# Altium project MoonPilot.PrjPcb
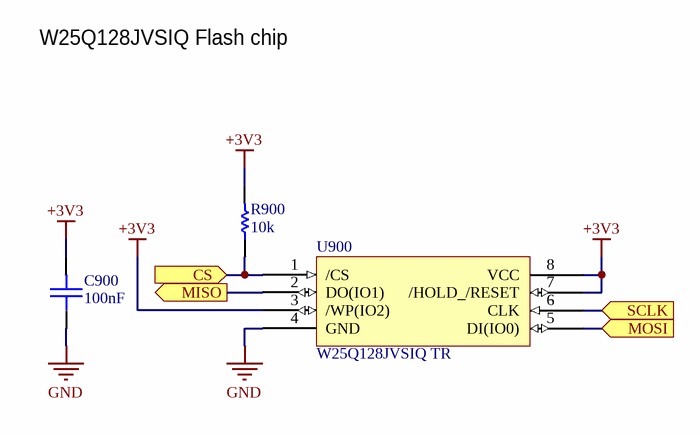
[diagram p0: Flash.SchDoc]
10 sheets, 117 parts. Net scope: hierarchical (ports join the sheet entries above them; power ports are global).
Board file: MoonPilot_Logic.PcbDoc
Sheets:
  Flash.SchDoc
  Main.SchDoc
    RP2040 = RP2040.SchDoc
    GNSS = GNSS.SchDoc
    IMU_MAG = IMU_MAG.SchDoc
    Power = Power.SchDoc
    Connectors = Connectors.SchDoc
    HI_CURR_1 = Hi_Current.SchDoc
    HI_CURR_2 = Hi_Current.SchDoc
    SD_Card = SD_Card.SchDoc
    LED & Buzzer = LED_Buzzer.SchDoc

## Sheet Flash.SchDoc: MoonPilot - Flash
size A3; DrawnBy: Máni Magnússon; Revision: A; SheetNumber: 9

### Parts
C900  100nF  [0603_CAP]
R900  10k  [0603_RES]
U900  W25Q128JVSIQ TR  [SOIC_208MIL_WIN]

### Ports
CS (in), MISO (out), MOSI (in), SCLK (in)

### Nets
+3V3: C900.1 R900.2 U900.3(/WP(IO2)) U900.7(/HOLD_/RESET) U900.8(VCC)
GND: C900.2 U900.4(GND)
NetR900_1: R900.1 U900.1(/CS) ; port CS
NetU900_2: U900.2(DO(IO1)) ; port MISO
NetU900_5: U900.5(DI(IO0)) ; port MOSI
NetU900_6: U900.6(CLK) ; port SCLK

### Notes on the sheet
- W25Q128JVSIQ Flash chip
- Sheet title:
- Revision:
- Drawn by:
- Date:
- File:

### Library data of the parts
C900 = Capacitor
R900 = Resistor
U900 = W25Q128JVSIQ TR: No Description Available; Vendor: Winbond; Built_By: EMA_Cory; SourceLibrary: Winbond_2020-02-06; Datasheet: https://www.winbond.com/resource-files/w25q128jv%20revf%2003272018%20plus.pdf; Manufacturer_Part_Number: W25Q128JVSIQ TR; Copyright: Copyright (C) 2018 Accelerated Designs. All rights reserved; RefDes: RefDes; Type: DEV

## Sheet Main.SchDoc: MoonPilot - Main
size A3; DrawnBy: Máni Magnússon; Revision: A; SheetNumber: 1
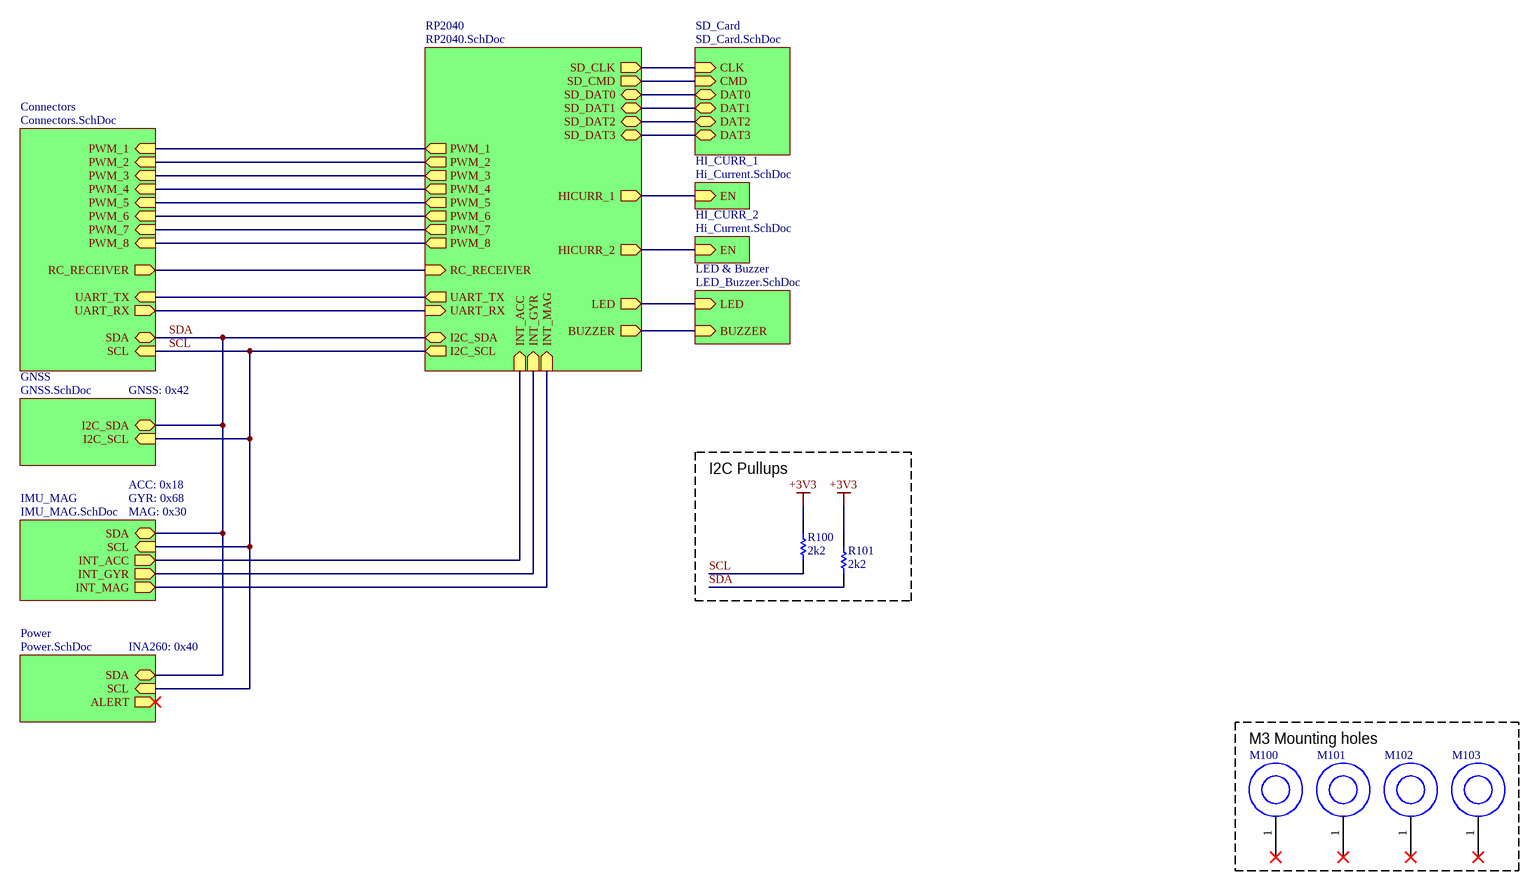
[diagram p1: Main.SchDoc]

### Parts
M100  Mounting Screw  [M3_SCREW]  (value not drawn)
M101  Mounting Screw  [M3_SCREW]  (value not drawn)
M102  Mounting Screw  [M3_SCREW]  (value not drawn)
M103  Mounting Screw  [M3_SCREW]  (value not drawn)
R100  2k2  [0603_RES]
R101  2k2  [0603_RES]

### Blocks framed on the sheet
I2C Pullups: R100 R101
M3 Mounting holes: M100-M103

### Sub-sheets
Connectors = Connectors.SchDoc: PWM_1 (in), PWM_2 (in), PWM_3 (in), PWM_4 (in), PWM_5 (in), PWM_6 (in), PWM_7 (in), PWM_8 (in), SDA (bidir), SCL (in), RC_RECEIVER (out), UART_TX (in), UART_RX (out)
GNSS = GNSS.SchDoc: I2C_SCL (in), I2C_SDA (bidir)
HI_CURR_1 = Hi_Current.SchDoc: EN (in)
HI_CURR_2 = Hi_Current.SchDoc: EN (in)
IMU_MAG = IMU_MAG.SchDoc: SDA (bidir), SCL (in), INT_ACC (out), INT_GYR (out), INT_MAG (out)
LED & Buzzer = LED_Buzzer.SchDoc: BUZZER (in), LED (in)
Power = Power.SchDoc: SCL (in), SDA (bidir), ALERT (out)
RP2040 = RP2040.SchDoc: PWM_1 (out), PWM_2 (out), PWM_3 (out), PWM_4 (out), PWM_5 (out), PWM_6 (out), PWM_7 (out), PWM_8 (out), HICURR_1 (out), HICURR_2 (out), UART_TX (out), UART_RX (in), I2C_SDA (bidir), I2C_SCL (out), SD_CLK (out), SD_CMD (out), SD_DAT0 (bidir), SD_DAT1 (bidir), SD_DAT2 (bidir), SD_DAT3 (bidir), RC_RECEIVER (in), LED (out), INT_MAG (in), INT_GYR (in), INT_ACC (in), BUZZER (out)
SD_Card = SD_Card.SchDoc: CLK (in), CMD (in), DAT0 (bidir), DAT1 (bidir), DAT2 (bidir), DAT3 (bidir)

### Nets
+3V3: R100.1 R101.1
SCL: R100.2 ; sheet RP2040/I2C_SCL, sheet GNSS/I2C_SCL, sheet IMU_MAG/SCL, sheet Power/SCL, sheet Connectors/SCL
SDA: R101.2 ; sheet RP2040/I2C_SDA, sheet GNSS/I2C_SDA, sheet IMU_MAG/SDA, sheet Power/SDA, sheet Connectors/SDA
NetJ600_1: sheet RP2040/PWM_1, sheet Connectors/PWM_1
NetJ601_1: sheet RP2040/PWM_2, sheet Connectors/PWM_2
NetJ602_1: sheet RP2040/PWM_3, sheet Connectors/PWM_3
NetJ603_1: sheet RP2040/PWM_4, sheet Connectors/PWM_4
NetJ604_1: sheet RP2040/PWM_5, sheet Connectors/PWM_5
NetJ605_2: sheet RP2040/RC_RECEIVER, sheet Connectors/RC_RECEIVER
NetJ606_1: sheet RP2040/PWM_6, sheet Connectors/PWM_6
NetJ607_1: sheet RP2040/PWM_7, sheet Connectors/PWM_7
NetJ608_1: sheet RP2040/PWM_8, sheet Connectors/PWM_8
NetJ609_2: sheet RP2040/UART_RX, sheet Connectors/UART_RX
NetJ609_3: sheet RP2040/UART_TX, sheet Connectors/UART_TX
NetJ800_P1: sheet RP2040/SD_DAT2, sheet SD_Card/DAT2
NetJ800_P2: sheet RP2040/SD_DAT3, sheet SD_Card/DAT3
NetJ800_P3: sheet RP2040/SD_CMD, sheet SD_Card/CMD
NetJ800_P5: sheet RP2040/SD_CLK, sheet SD_Card/CLK
NetJ800_P7: sheet RP2040/SD_DAT0, sheet SD_Card/DAT0
NetJ800_P8: sheet RP2040/SD_DAT1, sheet SD_Card/DAT1
NetQ1000_2: sheet RP2040/LED, sheet LED & Buzzer/LED
NetR700_HI_CURR_1_1: sheet RP2040/HICURR_1, sheet HI_CURR_1/EN
NetR700_HI_CURR_2_1: sheet RP2040/HICURR_2, sheet HI_CURR_2/EN
NetR1003_1: sheet RP2040/BUZZER, sheet LED & Buzzer/BUZZER
NetU201_11: sheet RP2040/INT_ACC, sheet IMU_MAG/INT_ACC
NetU201_12: sheet RP2040/INT_GYR, sheet IMU_MAG/INT_GYR
NetU201_13: sheet RP2040/INT_MAG, sheet IMU_MAG/INT_MAG

Not connected (* = marked no-connect by the designer): M100 1(19)*; M101 1(19)*; M102 1(19)*; M103 1(19)*

### Notes on the sheet
- GNSS: 0x42
- ACC: 0x18
- GYR: 0x68
- MAG: 0x30
- INA260: 0x40
- Sheet title:
- Revision:
- Drawn by:
- Date:
- File:

### Library data of the parts
M100-M103 = Mounting Screw: M4 and M3 scew holes, just pick the right footprint
R100 R101 = Resistor

## Sheet RP2040.SchDoc: MoonPilot - RP2040
size A3; DrawnBy: Máni Magnússon; Revision: A; SheetNumber: 2
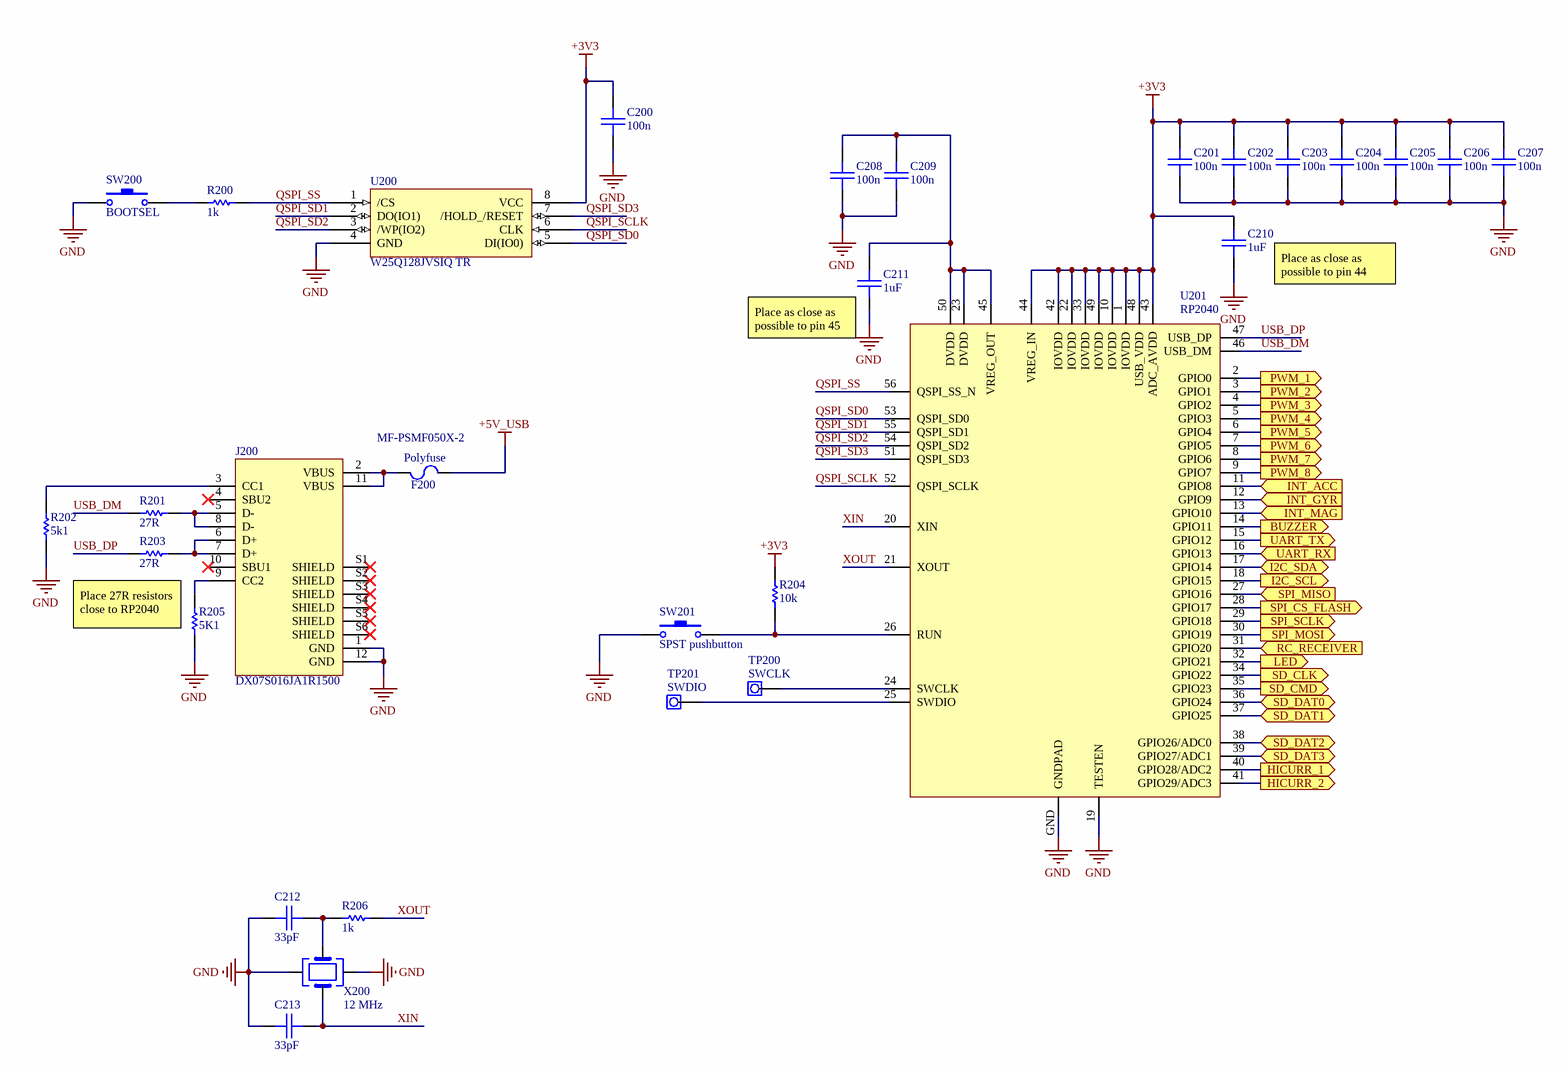
[diagram p2: RP2040.SchDoc]

### Parts
C200  100n  [0603_CAP]
C201  100n  [0603_CAP]
C202  100n  [0603_CAP]
C203  100n  [0603_CAP]
C204  100n  [0603_CAP]
C205  100n  [0603_CAP]
C206  100n  [0603_CAP]
C207  100n  [0603_CAP]
C208  100n  [0603_CAP]
C209  100n  [0603_CAP]
C210  1uF  [0603_CAP]
C211  1uF  [0603_CAP]
C212  33pF  [0603_CAP]
C213  33pF  [0603_CAP]
F200  Polyfuse  [0805]
J200  DX07S016JA1R1500  [JAE_DX07S016JA1R1500]
R200  1k  [0603_RES]
R201  27R  [0603_RES]
R202  5k1  [0603_RES]
R203  27R  [0603_RES]
R204  10k  [0805_RES]
R205  5K1  [0603_RES]
R206  1k  [0603_RES]
SW200  BOOTSEL  [TL1015]
SW201  SPST pushbutton  [TL1015]
TP200  SWCLK  [Testpoint]
TP201  SWDIO  [Testpoint]
U200  W25Q128JVSIQ TR  [SOIC_208MIL_WIN]
U201  RP2040  [RP2040]
X200  12 MHz  [XOSC_3.2mmx2.5mm]

### Ports
BUZZER (out), HICURR_1 (out), HICURR_2 (out), I2C_SCL (out), I2C_SDA (bidir), INT_ACC (in), INT_GYR (in), INT_MAG (in), LED (out), PWM_1 (out), PWM_2 (out), PWM_3 (out), PWM_4 (out), PWM_5 (out), PWM_6 (out), PWM_7 (out), PWM_8 (out), RC_RECEIVER (in), SD_CLK (out), SD_CMD (out), SD_DAT0 (bidir), SD_DAT1 (bidir), SD_DAT2 (bidir), SD_DAT3 (bidir), SPI_CS_FLASH (out), SPI_MISO (in), SPI_MOSI (out), SPI_SCLK (out), UART_RX (in), UART_TX (out)

### Nets
+3V3: C200.1 C201.1 C202.1 C203.1 C204.1 C205.1 C206.1 C207.1 C210.1 R204.1 U200.8(VCC) U201.1(IOVDD) U201.10(IOVDD) U201.22(IOVDD) U201.33(IOVDD) U201.42(IOVDD) U201.43(ADC_AVDD) U201.44(VREG_IN) U201.48(USB_VDD) U201.49(IOVDD)
+5V_USB: F200.2
GND: C200.2 C201.2 C202.2 C203.2 C204.2 C205.2 C206.2 C207.2 C208.2 C209.2 C210.2 C211.2 C212.2 C213.2 J200.1(GND) J200.12(GND) R202.2 R205.2 SW200.1 SW201.1 U200.4(GND) U201.19(TESTEN) U201.GND(GNDPAD) X200.2 X200.4
QSPI_SCLK: U200.6(CLK) U201.52(QSPI_SCLK)
QSPI_SD0: U200.5(DI(IO0)) U201.53(QSPI_SD0)
QSPI_SD1: U200.2(DO(IO1)) U201.55(QSPI_SD1)
QSPI_SD2: U200.3(/WP(IO2)) U201.54(QSPI_SD2)
QSPI_SD3: U200.7(/HOLD_/RESET) U201.51(QSPI_SD3)
QSPI_SS: R200.2 U200.1(/CS) U201.56(QSPI_SS_N)
SCL: U201.18(GPIO15) ; port I2C_SCL
SDA: U201.17(GPIO14) ; port I2C_SDA
USB_DM: R201.1 U201.46(USB_DM)
USB_DP: R203.1 U201.47(USB_DP)
XIN: C213.1 U201.20(XIN) X200.1
XOUT: R206.1 U201.21(XOUT)
NetC208_1: C208.1 C209.1 C211.1 U201.23(DVDD) U201.45(VREG_OUT) U201.50(DVDD)
NetC212_1: C212.1 R206.2 X200.3
NetF200_1: F200.1 J200.2(VBUS) J200.11(VBUS)
NetJ200_3: J200.3(CC1) R202.1
NetJ200_5: J200.5(D-) J200.8(D-) R201.2
NetJ200_6: J200.6(D+) J200.7(D+) R203.2
NetJ200_9: J200.9(CC2) R205.1
NetJ600_1: U201.2(GPIO0) ; port PWM_1
NetJ601_1: U201.3(GPIO1) ; port PWM_2
NetJ602_1: U201.4(GPIO2) ; port PWM_3
NetJ603_1: U201.5(GPIO3) ; port PWM_4
NetJ604_1: U201.6(GPIO4) ; port PWM_5
NetJ605_2: U201.31(GPIO20) ; port RC_RECEIVER
NetJ606_1: U201.7(GPIO5) ; port PWM_6
NetJ607_1: U201.8(GPIO6) ; port PWM_7
NetJ608_1: U201.9(GPIO7) ; port PWM_8
NetJ609_2: U201.16(GPIO13) ; port UART_RX
NetJ609_3: U201.15(GPIO12) ; port UART_TX
NetJ800_P1: U201.38(GPIO26/ADC0) ; port SD_DAT2
NetJ800_P2: U201.39(GPIO27/ADC1) ; port SD_DAT3
NetJ800_P3: U201.35(GPIO23) ; port SD_CMD
NetJ800_P5: U201.34(GPIO22) ; port SD_CLK
NetJ800_P7: U201.36(GPIO24) ; port SD_DAT0
NetJ800_P8: U201.37(GPIO25) ; port SD_DAT1
NetQ1000_2: U201.32(GPIO21) ; port LED
NetR200_1: R200.1 SW200.2
NetR204_2: R204.2 SW201.2 U201.26(RUN)
NetR700_HI_CURR_1_1: U201.40(GPIO28/ADC2) ; port HICURR_1
NetR700_HI_CURR_2_1: U201.41(GPIO29/ADC3) ; port HICURR_2
NetR1003_1: U201.14(GPIO11) ; port BUZZER
NetTP200_1: TP200.1 U201.24(SWCLK)
NetTP201_1: TP201.1 U201.25(SWDIO)
NetU201_11: U201.11(GPIO8) ; port INT_ACC
NetU201_12: U201.12(GPIO9) ; port INT_GYR
NetU201_13: U201.13(GPIO10) ; port INT_MAG
NetU201_27: U201.27(GPIO16) ; port SPI_MISO
NetU201_28: U201.28(GPIO17) ; port SPI_CS_FLASH
NetU201_29: U201.29(GPIO18) ; port SPI_SCLK
NetU201_30: U201.30(GPIO19) ; port SPI_MOSI

Not connected (* = marked no-connect by the designer): J200 4(SBU2)* 10(SBU1)* S1(SHIELD)* S2(SHIELD)* S3(SHIELD)* S4(SHIELD)* S5(SHIELD)* S6(SHIELD)*

### Notes on the sheet
- (near C210) Place as close as possible to pin 44
- (near C211) Place as close as possible to pin 45
- MF-PSMF050X-2
- (near R205) Place 27R resistors close to RP2040
- Sheet title:
- Revision:
- Drawn by:
- Date:
- File:

### Library data of the parts
C200-C213 = Capacitor
F200 = Fuse
J200 = DX07S016JA1R1500: USB 2.0 Type C Receptacle Dip Type, PCB Top Mount (Digikey part no. 670-DX07S016JA1R1500CT-ND); MF: JAE Electronics; Value: *; Price: None; Package: None; Availability: Unavailable; MP: DX07S016JA1R1500; DigiKey-Purchase-URL: https://snapeda.com/shop?store=DigiKey&id=4551013; SnapEDA_Link: https://www.snapeda.com/parts/DX07S016JA1R1500/JAE%20Electronics/view-part/4551013/?ref=snap
R200-R206 = Resistor
SW200 SW201 = PushButton: DigiKey part no. EG4344CT-ND
TP200 TP201 = Testpoint
U200 = W25Q128JVSIQ TR: as U900 on sheet Flash; Datasheet: https://www.winbond.com/resource-files/w25q128jv%20revf%2003272018%20plus.pdf; Manufacturer_Part_Number: W25Q128JVSIQ TR; Copyright: Copyright (C) 2018 Accelerated Designs. All rights reserved; RefDes: RefDes; Type: DEV
X200 = XTAL_12 MHz: 12 MHz crystal oscillator / ECS-120-20-33-CKM-TR / DigiKey part no. XC1810CT-ND; ComponentLink1Description: DigiKey; ComponentLink1URL: https://www.digikey.com/en/products/detail/ecs-inc/ECS-120-20-33-CKM-TR/2781815; DigiKey: XC1810CT-ND

## Sheet GNSS.SchDoc: MoonPilot - GNSS
size A3; DrawnBy: Máni Magnússon; Revision: A; SheetNumber: 3
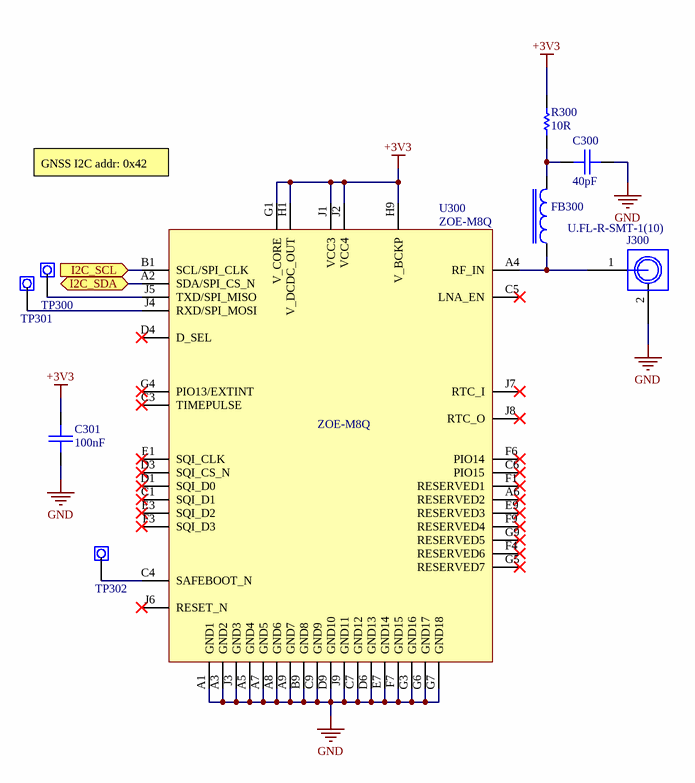
[diagram p3: GNSS.SchDoc]

### Parts
C300  40pF  [0603_CAP]
C301  100nF  [0603_CAP]
FB300  FBTH1608HL221-T  [0603_FERRITE]  (value not drawn)
J300  U.FL-R-SMT-1(10)  [U.FL-R-SMT-1(10)]
R300  10R  [0603_RES]
TP300  GPS_TX  [Testpoint]  (value not drawn)
TP301  GPS_RX  [Testpoint]  (value not drawn)
TP302  GPS_SAFEBOOT  [Testpoint2]  (value not drawn)
U300  ZOE-M8Q  [ZOE-M8Q]

### Ports
I2C_SCL (in), I2C_SDA (bidir)

### Nets
+3V3: C301.1 R300.1 U300.G1(V_CORE) U300.H1(V_DCDC_OUT) U300.H9(V_BCKP) U300.J1(VCC3) U300.J2(VCC4)
GND: C300.2 C301.2 J300.2(GND) U300.A1(GND1) U300.A3(GND2) U300.A5(GND4) U300.A7(GND5) U300.A8(GND6) U300.A9(GND7) U300.B9(GND8) U300.C7(GND12) U300.C9(GND9) U300.D6(GND13) U300.D9(GND10) U300.E7(GND14) U300.F7(GND15) U300.G3(GND16) U300.G6(GND17) U300.G7(GND18) U300.J3(GND3) U300.J9(GND11)
SCL: U300.B1(SCL/SPI_CLK) ; port I2C_SCL
SDA: U300.A2(SDA/SPI_CS_N) ; port I2C_SDA
NetC300_1: C300.1 FB300.2 R300.2
NetFB300_1: FB300.1 J300.1(SIG) U300.A4(RF_IN)
NetTP300_1: TP300.1 U300.J5(TXD/SPI_MISO)
NetTP301_1: TP301.1 U300.J4(RXD/SPI_MOSI)
NetTP302_1: TP302.1 U300.C4(SAFEBOOT_N)

Not connected (* = marked no-connect by the designer): U300 A6(RESERVED2)* C1(SQI_D1)* C3(TIMEPULSE)* C5(LNA_EN)* C6(PIO15)* D1(SQI_D0)* D3(SQI_CS_N)* D4(D_SEL)* E1(SQI_CLK)* E3(SQI_D2)* E9(RESERVED3)* F1(RESERVED1)* F3(SQI_D3)* F4(RESERVED6)* F6(PIO14)* F9(RESERVED4)* G4(PIO13/EXTINT)* G5(RESERVED7)* G9(RESERVED5)* J6(RESET_N)* J7(RTC_I)* J8(RTC_O)*

### Notes on the sheet
- GNSS I2C addr: 0x42
- Sheet title:
- Revision:
- Drawn by:
- Date:
- File:

### Library data of the parts
C300 C301 = Capacitor
FB300 = Ferrite Bead: Digikey part no. / 587-FBTH1608HL221-TCT-ND
J300 = U.FL SMD: Digikey part no. H11891CT-ND
R300 = Resistor
TP300-TP302 = Testpoint
U300 = ZOE-M8Q: u-blox ZOE GNSS module; Part Description: u-blox ZOE-M8Q GNSS module; Manufacturer: u-blox; Value: ZOE-M8Q

## Sheet IMU_MAG.SchDoc: MoonPilot - IMU & MAG
size A3; DrawnBy: Máni Magnússon; Revision: A; SheetNumber: 4
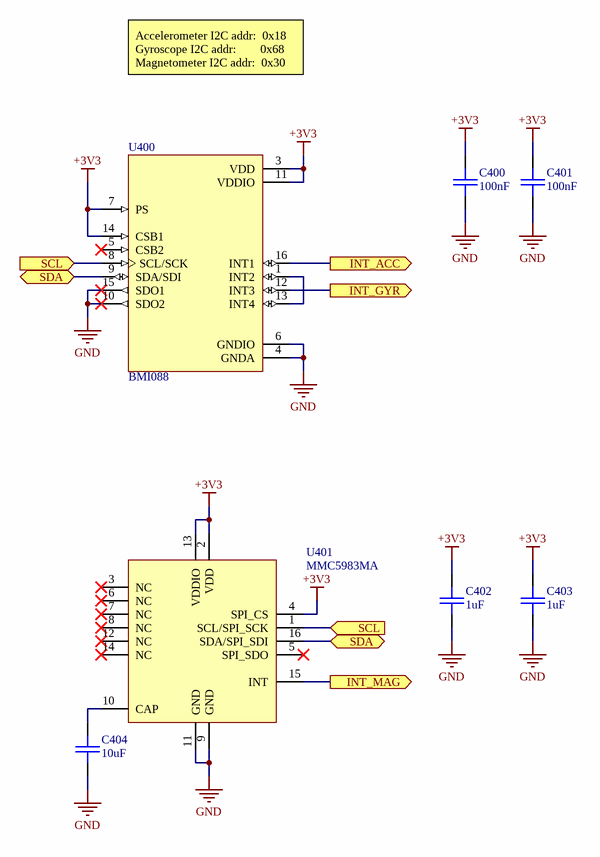
[diagram p4: IMU_MAG.SchDoc]

### Parts
C400  100nF  [0603_CAP]
C401  100nF  [0603_CAP]
C402  1uF  [0603_CAP]
C403  1uF  [0603_CAP]
C404  10uF  [0603_CAP]
U400  BMI088  [BMI088]
U401  MMC5983MA  [MMC5983MA]

### Ports
INT_ACC (out), INT_GYR (out), INT_MAG (out), SCL (in), SDA (bidir)

### Nets
+3V3: C400.1 C401.1 C402.1 C403.1 U400.3(VDD) U400.7(PS) U400.11(VDDIO) U400.14(CSB1) U401.2(VDD) U401.4(SPI_CS) U401.13(VDDIO)
GND: C400.2 C401.2 C402.2 C403.2 C404.2 U400.4(GNDA) U400.6(GNDIO) U400.10(SDO2) U400.15(SDO1) U401.9(GND) U401.11(GND)
SCL: U400.8(SCL/SCK) U401.1(SCL/SPI_SCK) ; port SCL
SDA: U400.9(SDA/SDI) U401.16(SDA/SPI_SDI) ; port SDA
NetC404_1: C404.1 U401.10(CAP)
NetU201_11: U400.16(INT1) ; port INT_ACC
NetU201_12: U400.12(INT3) ; port INT_GYR
NetU201_13: U401.15(INT) ; port INT_MAG
NetU400_1: U400.1(INT2) U400.13(INT4)

Not connected (* = marked no-connect by the designer): U400 5(CSB2)*; U401 3(NC)* 5(SPI_SDO)* 6(NC)* 7(NC)* 8(NC)* 12(NC)* 14(NC)*

### Notes on the sheet
- Accelerometer I2C addr:  0x18
  Gyroscope I2C addr:        0x68
  Magnetometer I2C addr:  0x30
- Sheet title:
- Revision:
- Drawn by:
- Date:
- File:

### Library data of the parts
C400-C404 = Capacitor
U400 = BMI088: Digikey part no. 828-1082-1-ND; MF: Bosch Sensortec; Availability: Unavailable; MP: BMI088; Price: None; Value: *; SnapEDA_Link: https://www.snapeda.com/parts/BMI088/Bosch%20Sensortec/view-part/2774026/?ref=snap; Package: VFLGA-16 Bosch Sensortec
U401 = MMC5983MA: 3 axis magnetometer; Supplier 1: Digi-Key; Supplier Part Number 1: 1267-MMC5983MACT-ND

## Sheet Power.SchDoc: MoonPilot -  Power
size A3; DrawnBy: Máni Magnússon; Revision: A; SheetNumber: 5
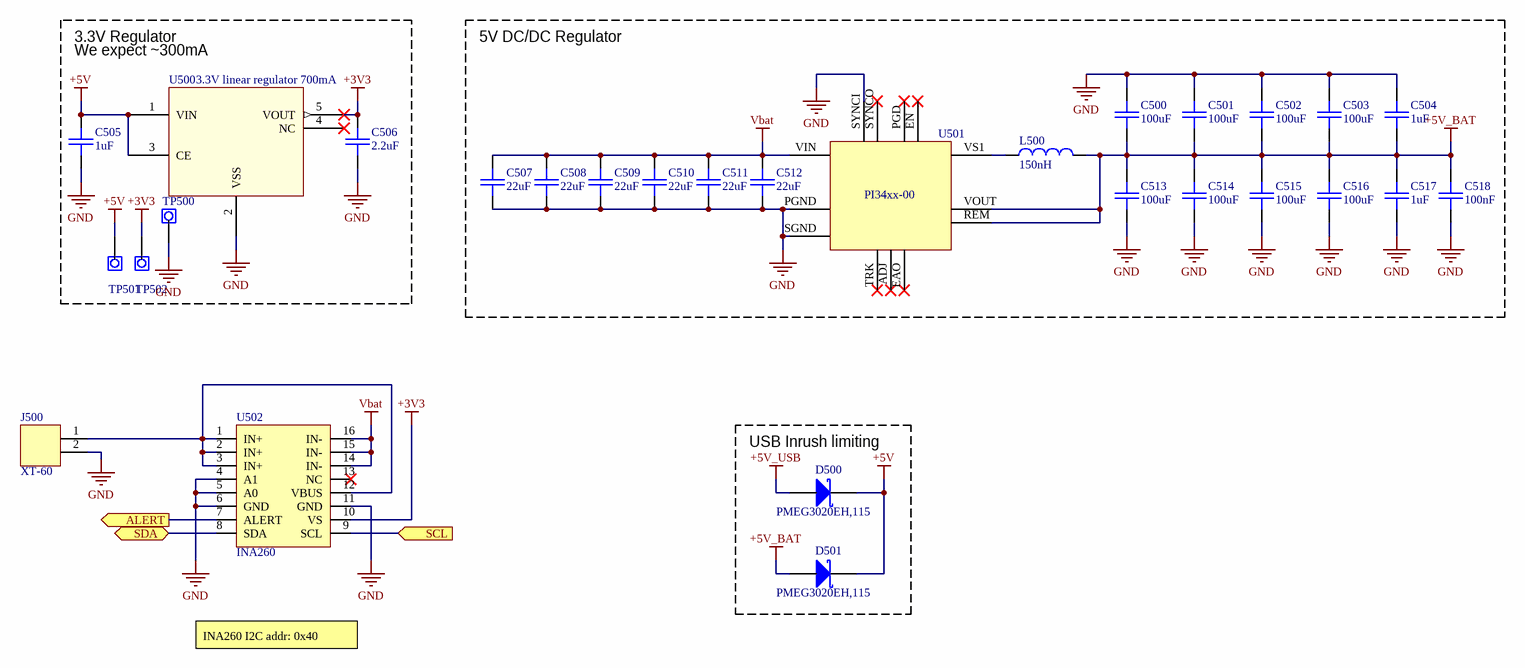
[diagram p5: Power.SchDoc]

### Parts
C500  100uF  [1206_CAP]
C501  100uF  [1206_CAP]
C502  100uF  [1206_CAP]
C503  100uF  [1206_CAP]
C504  1uF  [0805_cap]
C505  1uF  [0603_CAP]
C506  2.2uF  [0603_CAP]
C507  22uF  [1206_CAP]
C508  22uF  [1206_CAP]
C509  22uF  [1206_CAP]
C510  22uF  [1206_CAP]
C511  22uF  [1206_CAP]
C512  22uF  [1206_CAP]
C513  100uF  [1206_CAP]
C514  100uF  [1206_CAP]
C515  100uF  [1206_CAP]
C516  100uF  [1206_CAP]
C517  1uF  [0805_cap]
C518  100nF  [1206_CAP]
D500  PMEG3020EH,115  [SOD-123]
D501  PMEG3020EH,115  [SOD-123]
J500  XT-60  [XT-60]
L500  150nH  [FPV1006-150-R]
TP500  GND  [Testpoint2]  (value not drawn)
TP501  5V  [Testpoint2]  (value not drawn)
TP502  3.3V  [Testpoint2]  (value not drawn)
U500  3.3V linear regulator 700mA  [SOT-25_TOR]
U501  PI34xx-00  [PI34xx-00]
U502  INA260  [TSSOP-16]

### Blocks framed on the sheet
5V DC/DC Regulator: C500-C504 C507-C518 L500 U501
USB Inrush limiting: D500 D501

### Ports
ALERT (out), SCL (in), SDA (bidir)

### Nets
+3V3: C506.1 TP502.1 U500.5(VOUT) U502.10(VS)
+5V: C505.1 D500.2(K) D501.2(K) TP501.1 U500.1(VIN) U500.3(CE)
+5V_BAT: C500.2 C501.2 C502.2 C503.2 C504.2 C513.1 C514.1 C515.1 C516.1 C517.1 C518.1 D501.1(A) L500.2 U501.REM U501.VOUT
+5V_USB: D500.1(A)
GND: C500.1 C501.1 C502.1 C503.1 C504.1 C505.2 C506.2 C507.2 C508.2 C509.2 C510.2 C511.2 C512.2 C513.2 C514.2 C515.2 C516.2 C517.2 C518.2 J500.2 TP500.1 U500.2(VSS) U501.PGND U501.SGND U501.SYNCI U502.4(A1) U502.5(A0) U502.6(GND) U502.11(GND)
Vbat: C507.1 C508.1 C509.1 C510.1 C511.1 C512.1 U501.VIN U502.14(IN-) U502.15(IN-) U502.16(IN-)
SCL: U502.9(SCL) ; port SCL
SDA: U502.8(SDA) ; port SDA
NetJ500_1: J500.1 U502.1(IN+) U502.2(IN+) U502.3(IN+) U502.12(VBUS)
NetL500_1: L500.1 U501.VS1
NetU502_7: U502.7(ALERT) ; port ALERT

Not connected (* = marked no-connect by the designer): U500 4(NC)*; U501 ADJ* EAO* EN* PGD* SYNCO* TRK*; U502 13(NC)*

### Notes on the sheet
- 3.3V Regulator
- We expect ~300mA
- INA260 I2C addr: 0x40
- Sheet title:
- Revision:
- Drawn by:
- Date:
- File:

### Library data of the parts
C500-C518 = Capacitor
D500 D501 = Schottky diode
J500 = XT-60: Digikey part no. 1568-1816-ND
L500 = Inductor
TP500-TP502 = Testpoint
U500 = XC6222B331MR-G: Digikey part no. 893-1143-1-ND; Vendor: Torex Semiconductor; Built_By: EMA_UL_Team; SourceLibrary: Torex_2016-07-11_1; Manufacturer_Part_Number: XC6222B331MR-G; Copyright: Copyright (C) 2018 Accelerated Designs. All rights reserved; RefDes: RefDes; Type: DEV
U501 = PI34xx-00: Digikey part no. 1102-1641-ND
U502 = INA260: ComponentLink1Description: Datasheet; ComponentLink1URL: https://www.ti.com/lit/ds/symlink/ina260.pdf?ts=1625223015380&ref_url=https%253A%252F%252Fwww.google.com%252F

## Sheet Connectors.SchDoc: MoonPilot - Connectors
size A3; DrawnBy: Máni Magnússon; Revision: A; SheetNumber: 6
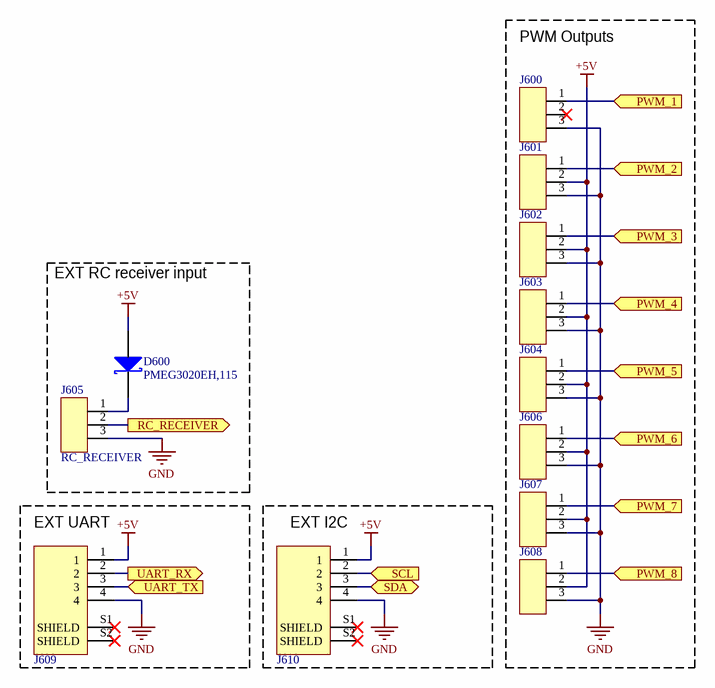
[diagram p6: Connectors.SchDoc]

### Parts
D600  PMEG3020EH,115  [SOD-123]
J600  Generic 3 pin 100 mil header  [HEADER-3-POS_100_mil]  (value not drawn)
J601  Generic 3 pin 100 mil header  [HEADER-3-POS_100_mil]  (value not drawn)
J602  Generic 3 pin 100 mil header  [HEADER-3-POS_100_mil]  (value not drawn)
J603  Generic 3 pin 100 mil header  [HEADER-3-POS_100_mil]  (value not drawn)
J604  Generic 3 pin 100 mil header  [HEADER-3-POS_100_mil]  (value not drawn)
J605  RC_RECEIVER  [HEADER-3-POS_100_mil]
J606  Generic 3 pin 100 mil header  [HEADER-3-POS_100_mil]  (value not drawn)
J607  Generic 3 pin 100 mil header  [HEADER-3-POS_100_mil]  (value not drawn)
J608  Generic 3 pin 100 mil header  [HEADER-3-POS_100_mil]  (value not drawn)
J609  4 pin vertical JST GH  [JST_BM04B-GHS-TBT(LF)(SN)(N)]  (value not drawn)
J610  4 pin vertical JST GH  [JST_BM04B-GHS-TBT(LF)(SN)(N)]  (value not drawn)

### Blocks framed on the sheet
PWM Outputs: J600-J604 J606-J608
EXT RC receiver input: D600 J605
EXT UART: J609
EXT I2C: J610

### Ports
PWM_1 (in), PWM_2 (in), PWM_3 (in), PWM_4 (in), PWM_5 (in), PWM_6 (in), PWM_7 (in), PWM_8 (in), RC_RECEIVER (out), SCL (in), SDA (bidir), UART_RX (out), UART_TX (in)

### Nets
+5V: D600.1(A) J601.2 J602.2 J603.2 J604.2 J606.2 J607.2 J608.2 J609.1 J610.1
GND: J600.3 J601.3 J602.3 J603.3 J604.3 J605.3 J606.3 J607.3 J608.3 J609.4 J610.4
SCL: J610.2 ; port SCL
SDA: J610.3 ; port SDA
NetD600_2: D600.2(K) J605.1
NetJ600_1: J600.1 ; port PWM_1
NetJ601_1: J601.1 ; port PWM_2
NetJ602_1: J602.1 ; port PWM_3
NetJ603_1: J603.1 ; port PWM_4
NetJ604_1: J604.1 ; port PWM_5
NetJ605_2: J605.2 ; port RC_RECEIVER
NetJ606_1: J606.1 ; port PWM_6
NetJ607_1: J607.1 ; port PWM_7
NetJ608_1: J608.1 ; port PWM_8
NetJ609_2: J609.2 ; port UART_RX
NetJ609_3: J609.3 ; port UART_TX

Not connected (* = marked no-connect by the designer): J600 2(*)*; J609 S1(SHIELD)* S2(SHIELD)*; J610 S1(SHIELD)* S2(SHIELD)*

### Notes on the sheet
- Sheet title:
- Revision:
- Drawn by:
- Date:
- File:

### Library data of the parts
D600 = Schottky diode: Digikey part no. 1727-3873-1-ND
J600-J608 = 3 pin 100 mil header
J609 J610 = BM04B-GHS-TBT(LF)(SN)(N): JST GH vertical 4 pin / DigiKey part no. 455-1580-1-ND; MF: JST Sales; MP: BM04B-GHS-TBT_LF__SN__N_; SnapEDA_Link: https://www.snapeda.com/parts/BM04B-GHS-TBT%28LF%29%28SN%29%28N%29/JST%20Sales%20America%20Inc./view-part/841999/?ref=snap; Digi-Key_Part_Number: 455-1580-1-ND; Digi-Key_Purchase_URL: https://www.digikey.com/product-detail/en/jst-sales-america-inc/BM04B-GHS-TBT_LF__SN__N_/455-1580-1-ND/807848?utm_source=snapeda&utm_medium=aggregator&utm_campaign=symbol; Value: *; Package: None

## Sheet Hi_Current.SchDoc: MoonPilot - Hi Current Out
size A3; DrawnBy: Máni Magnússon; Revision: A; SheetNumber: 7
Used 2 times, as channels HI_CURR_1, HI_CURR_2. Parts and nets are listed once, with the designators drawn on the sheet.
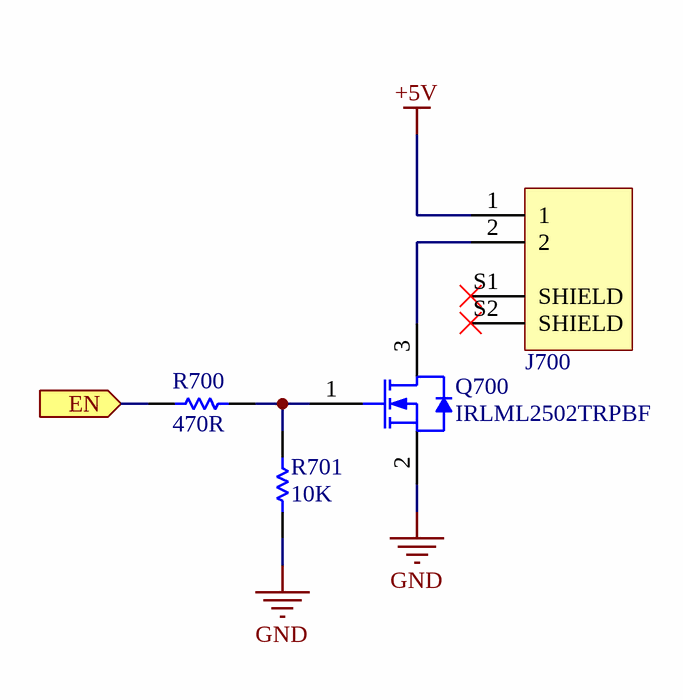
[diagram p7: Hi_Current.SchDoc]

### Parts
J700  2 pin vertical JST GH  [JST_BM02B-GHS-TBT(LF)(SN)(N)]  (value not drawn)
Q700  IRLML2502TRPBF  [INTR-SOT-23-3_V]
R700  470R  [0603_RES]
R701  10K  [0603_RES]

### Ports
EN (in)

### Nets
+5V: J700.1
GND: Q700.2(S) R701.2
EN: R700.1 ; port EN
NetJ700_2: J700.2 Q700.3(D)
NetQ700_1: Q700.1(G) R700.2 R701.1

Not connected (* = marked no-connect by the designer): J700 S1(SHIELD)* S2(SHIELD)*

### Channels
HI_CURR_1: designators end in _HI_CURR_1; ports EN=NetR700_HI_CURR_1_1
HI_CURR_2: designators end in _HI_CURR_2; ports EN=NetR700_HI_CURR_2_1

### Notes on the sheet
- Sheet title:
- Revision:
- Drawn by:
- Date:
- File:

### Library data of the parts
J700 = BM02B-GHS-TBT(LF)(SN)(N): JST GH vertical 2 pin / DigiKey part no. 455-1578-1-ND; MF: JST Sales; MP: BM04B-GHS-TBT_LF__SN__N_; SnapEDA_Link: https://www.snapeda.com/parts/BM04B-GHS-TBT%28LF%29%28SN%29%28N%29/JST%20Sales%20America%20Inc./view-part/841999/?ref=snap; Digi-Key_Part_Number: 455-1580-1-ND; Digi-Key_Purchase_URL: https://www.digikey.com/product-detail/en/jst-sales-america-inc/BM04B-GHS-TBT_LF__SN__N_/455-1580-1-ND/807848?utm_source=snapeda&utm_medium=aggregator&utm_campaign=symbol; Value: *; Package: None
Q700 = IRLML2502TRPBF: N-Channel HEXFET(R) Power MOSFET, 20 V VDS, +/- 12 V VGS, 4.2 A, 3-Pin SOT23, RoHS, Tape and Reel; Manufacturer: International Rectifier; Drain-to-Source Voltage [Vdss]: 20V; Drain-Source On Resistance-Max: 0.045O; Qg Gate Charge: 8nC; Rated Power Dissipation: 1.25W; Package Reference: SOT-23-3; Manufacturer URL: http://internationalrectifier.com/; Package Description: 3-Pin Small Outline Transistor, Body 2.92 x 1.3 mm, Pitch 0.95 mm; Datasheet Version: Apr-14; Channel Type: N-Channel; Datasheet URL: https://datasheet.ciiva.com/6383/irlml2502pbf-6383216.pdf
R700 R701 = Resistor

## Sheet SD_Card.SchDoc: MoonPilot - SD Card
size A3; DrawnBy: Máni Magnússon; Revision: A; SheetNumber: 8
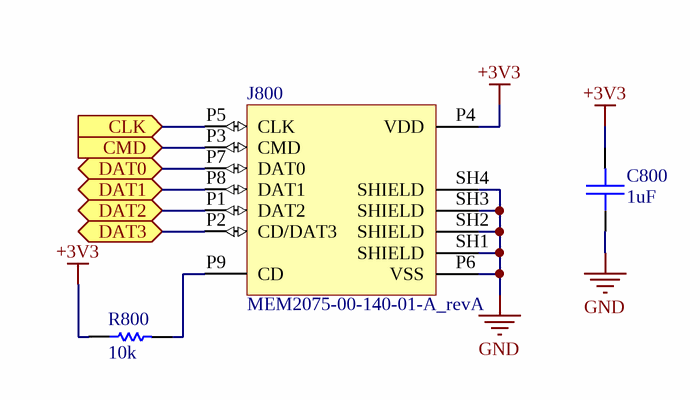
[diagram p8: SD_Card.SchDoc]

### Parts
C800  1uF  [0603_CAP]
J800  MEM2075-00-140-01-A_revA  [MEM2075-00-140-01-A_revA]
R800  10k  [0603_RES]

### Ports
CLK (in), CMD (in), DAT0 (bidir), DAT1 (bidir), DAT2 (bidir), DAT3 (bidir)

### Nets
+3V3: C800.1 J800.P4(VDD) R800.1
GND: C800.2 J800.P6(VSS) J800.SH1(SHIELD) J800.SH2(SHIELD) J800.SH3(SHIELD) J800.SH4(SHIELD)
NetJ800_P1: J800.P1(DAT2) ; port DAT2
NetJ800_P2: J800.P2(CD/DAT3) ; port DAT3
NetJ800_P3: J800.P3(CMD) ; port CMD
NetJ800_P5: J800.P5(CLK) ; port CLK
NetJ800_P7: J800.P7(DAT0) ; port DAT0
NetJ800_P8: J800.P8(DAT1) ; port DAT1
NetJ800_P9: J800.P9(CD) R800.2

### Notes on the sheet
- Sheet title:
- Revision:
- Drawn by:
- Date:
- File:

### Library data of the parts
C800 = Capacitor
J800 = MicroSD Card holder: Push-Push style MicroSD Card holder / Digikey part no. 2073-MEM2075-00-140-01-ACT-ND; Manufacturer: GCT; PartRev: A; STANDARD: Manufacturer Recommendations; Package: GCT_MEM2075-00-140-01-A_revA
R800 = Resistor

## Sheet LED_Buzzer.SchDoc: MoonPilot - LED & Buzzer
size A3; DrawnBy: Máni Magnússon; Revision: A; SheetNumber: 10
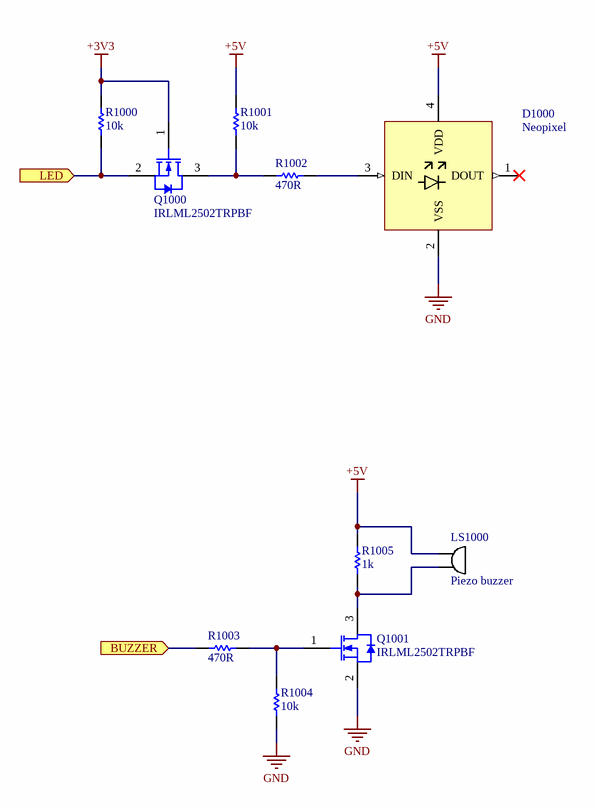
[diagram p9: LED_Buzzer.SchDoc]

### Parts
D1000  Neopixel  [2659]
LS1000  Piezo buzzer  [CPT-9019S-SMT-TR]
Q1000  IRLML2502TRPBF  [INTR-SOT-23-3_V]
Q1001  IRLML2502TRPBF  [INTR-SOT-23-3_V]
R1000  10k  [0603_RES]
R1001  10k  [0603_RES]
R1002  470R  [0603_RES]
R1003  470R  [0603_RES]
R1004  10k  [0603_RES]
R1005  1k  [0603_RES]

### Ports
BUZZER (in), LED (in)

### Nets
+3V3: Q1000.1(G) R1000.2
+5V: D1000.4(VDD) LS1000.1 R1001.1 R1005.1
GND: D1000.2(VSS) Q1001.2(S) R1004.1
NetD1000_3: D1000.3(DIN) R1002.2
NetLS1000_2: LS1000.2 Q1001.3(D) R1005.2
NetQ1000_2: Q1000.2(S) R1000.1 ; port LED
NetQ1000_3: Q1000.3(D) R1001.2 R1002.1
NetQ1001_1: Q1001.1(G) R1003.2 R1004.2
NetR1003_1: R1003.1 ; port BUZZER

Not connected (* = marked no-connect by the designer): D1000 1(DOUT)*

### Notes on the sheet
- Sheet title:
- Revision:
- Drawn by:
- Date:
- File:

### Library data of the parts
D1000 = Neopixel: Adafruit Neopixel SMD 3535 / Adafruit part no. 2659 / Digikey part no. 1528-1542-ND; MF: Adafruit Industries; MP: 2659; SnapEDA_Link: https://www.snapeda.com/parts/2659/Adafruit%20Industries%20LLC/view-part/548522/?ref=snap; Package: TQFP-32 Adafruit Industries; Digi-Key_Purchase_URL: https://www.digikey.com/product-detail/en/pololu-corporation/2659/2183-2659-ND/10451102?utm_source=snapeda&utm_medium=aggregator&utm_campaign=symbol; Digi-Key_Part_Number: 2183-2659-ND; Value: *
LS1000 = Buzzer: 4kHz 65 dB @ 3V passive piezoelectric buzzer; Supplier 1: Digi-Key; Supplier Part Number 1: 102-3761-1-ND
Q1000 Q1001 = IRLML2502TRPBF: as Q700 on sheet Hi_Current; Package Reference: SOT-23-3; Manufacturer URL: http://internationalrectifier.com/; Package Description: 3-Pin Small Outline Transistor, Body 2.92 x 1.3 mm, Pitch 0.95 mm; Datasheet Version: Apr-14; Channel Type: N-Channel; Datasheet URL: https://datasheet.ciiva.com/6383/irlml2502pbf-6383216.pdf
R1000-R1005 = Resistor

## Nets that join several sheets
+3V3: Flash (5 pins), Main (R100.1 R101.1), RP2040 (20 pins), GNSS (7 pins), IMU_MAG (11 pins), Power (C506.1 TP502.1 U500.5 U502.10), SD_Card (C800.1 J800.P4 R800.1), LED_Buzzer (Q1000.1 R1000.2)
+5V: Power (6 pins), Connectors (10 pins), HI_CURR_1 (J700_HI_CURR_1.1), HI_CURR_2 (J700_HI_CURR_2.1), LED_Buzzer (D1000.4 LS1000.1 R1001.1 R1005.1)
+5V_USB: RP2040 (F200.2), Power (D500.1)
GND: Flash (C900.2 U900.4), RP2040 (25 pins), GNSS (21 pins), IMU_MAG (11 pins), Power (29 pins), Connectors (11 pins), HI_CURR_1 (Q700_HI_CURR_1.2 R701_HI_CURR_1.2), HI_CURR_2 (Q700_HI_CURR_2.2 R701_HI_CURR_2.2), SD_Card (6 pins), LED_Buzzer (D1000.2 Q1001.2 R1004.1)
NetJ600_1: RP2040 (U201.2), Connectors (J600.1)
NetJ601_1: RP2040 (U201.3), Connectors (J601.1)
NetJ602_1: RP2040 (U201.4), Connectors (J602.1)
NetJ603_1: RP2040 (U201.5), Connectors (J603.1)
NetJ604_1: RP2040 (U201.6), Connectors (J604.1)
NetJ605_2: RP2040 (U201.31), Connectors (J605.2)
NetJ606_1: RP2040 (U201.7), Connectors (J606.1)
NetJ607_1: RP2040 (U201.8), Connectors (J607.1)
NetJ608_1: RP2040 (U201.9), Connectors (J608.1)
NetJ609_2: RP2040 (U201.16), Connectors (J609.2)
NetJ609_3: RP2040 (U201.15), Connectors (J609.3)
NetJ800_P1: RP2040 (U201.38), SD_Card (J800.P1)
NetJ800_P2: RP2040 (U201.39), SD_Card (J800.P2)
NetJ800_P3: RP2040 (U201.35), SD_Card (J800.P3)
NetJ800_P5: RP2040 (U201.34), SD_Card (J800.P5)
NetJ800_P7: RP2040 (U201.36), SD_Card (J800.P7)
NetJ800_P8: RP2040 (U201.37), SD_Card (J800.P8)
NetQ1000_2: RP2040 (U201.32), LED_Buzzer (Q1000.2 R1000.1)
NetR700_HI_CURR_1_1: RP2040 (U201.40), HI_CURR_1 (R700_HI_CURR_1.1)
NetR700_HI_CURR_2_1: RP2040 (U201.41), HI_CURR_2 (R700_HI_CURR_2.1)
NetR1003_1: RP2040 (U201.14), LED_Buzzer (R1003.1)
NetU201_11: RP2040 (U201.11), IMU_MAG (U400.16)
NetU201_12: RP2040 (U201.12), IMU_MAG (U400.12)
NetU201_13: RP2040 (U201.13), IMU_MAG (U401.15)
SCL: Main (R100.2), RP2040 (U201.18), GNSS (U300.B1), IMU_MAG (U400.8 U401.1), Power (U502.9), Connectors (J610.2)
SDA: Main (R101.2), RP2040 (U201.17), GNSS (U300.A2), IMU_MAG (U400.9 U401.16), Power (U502.8), Connectors (J610.3)